# EAGLE design connector_2x2 (EAGLE 9.4.2)
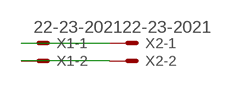
[diagram p0: schematic, sheet 1]

## Parts
X1  22-23-2021  [22-23-2021]
X2  22-23-2021  [22-23-2021]

## Nets
N$1: X1.1 X2.1
N$2: X1.2 X2.2

## Library data of the parts
X1 X2 = con-molex:22-23-2021: .100" (2.54mm) Center Header - 2 Pin; MF: MOLEX; MPN: 22-23-2021; OC_FARNELL: 1462926; OC_NEWARK: 25C3832

## Board
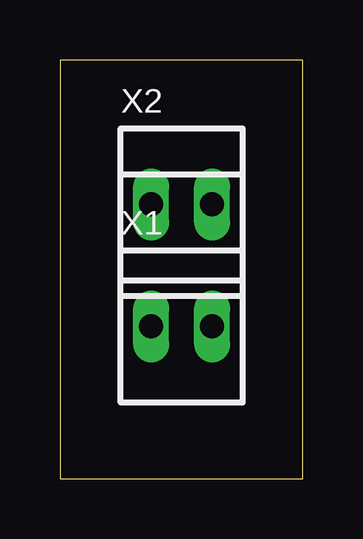
[diagram p1: board, top side]
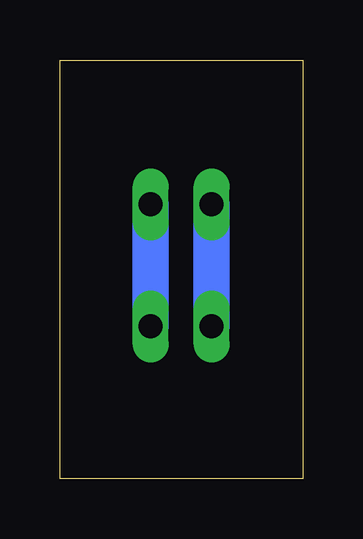
[diagram p2: board, bottom side, seen from below]

Size 10.14 x 17.45 mm. Coordinates in mm from the lower left corner, seen from the top.
Outline: 0,0 10.14,0 10.14,17.45 0,17.45 0,0
Copper layers (1*16): Top 0.035mm / dielectric 1.5mm / Bottom 0.035mm
Design rules "default": minimum track width 6mil, minimum drill 0.35mm, track to track 6mil, track to pad 6mil, pad to pad 6mil, via to via 6mil, smd to smd 6mil, copper to edge 40mil, drill to drill 6mil, minimum pad ring 10mil, minimum via ring 8mil, stop-mask expansion 4mil, vias tented up to drill 0mil, thermal gap 10mil

### Footprints (pad centres in the part's own frame; a part is rotated, then mirrored left to right if it is on the bottom)
22-23-2021 = drill 1 long: 1 -1.27,0; 2 1.27,0

### Placement (x,y rotation side)
X1  5.08,6.35 0 top
X2  5.08,11.43 0 top

### Tracks (layer width: path | path; a pad name or v marks a point on that pad's centre or on a via)
N$1
  Bottom 1.524: X2.1 X1.1
N$2
  Bottom 1.524: X1.2 X2.2